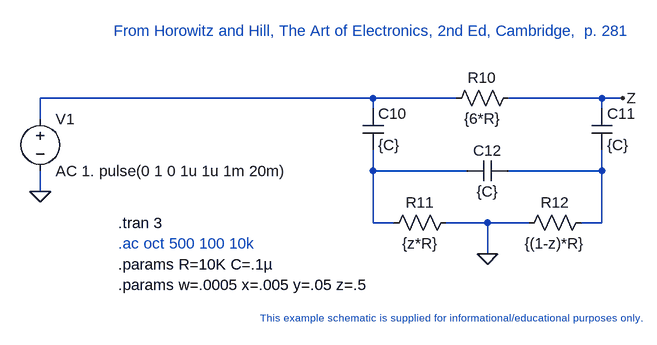
[diagram p0: schematic n.asc]
n.asc, the LTspice schematic file:
Version 4
SHEET 1 5945676 13421556
WIRE 3024 -432 2512 -432
WIRE 3152 -432 3024 -432
WIRE 3376 -432 3232 -432
WIRE 3408 -432 3376 -432
WIRE 3024 -416 3024 -432
WIRE 3376 -416 3376 -432
WIRE 2512 -400 2512 -432
WIRE 3024 -320 3024 -352
WIRE 3168 -320 3024 -320
WIRE 3376 -320 3376 -352
WIRE 3376 -320 3232 -320
WIRE 2512 -288 2512 -320
WIRE 3024 -240 3024 -320
WIRE 3056 -240 3024 -240
WIRE 3200 -240 3136 -240
WIRE 3264 -240 3200 -240
WIRE 3376 -240 3376 -320
WIRE 3376 -240 3344 -240
WIRE 3200 -192 3200 -240
FLAG 2512 -288 0
FLAG 3200 -192 0
FLAG 3408 -432 Z
SYMBOL voltage 2512 -416 R0
SYMATTR InstName V1
SYMATTR Value AC 1. pulse(0 1 0 1u 1u 1m 20m)
SYMBOL res 3248 -448 R90
WINDOW 0 0 56 VBottom 2
WINDOW 3 32 56 VTop 2
SYMATTR InstName R10
SYMATTR Value {6*R}
SYMBOL cap 3008 -416 R0
SYMATTR InstName C10
SYMATTR Value {C}
SYMBOL cap 3360 -416 R0
SYMATTR InstName C11
SYMATTR Value {C}
SYMBOL cap 3232 -336 R90
WINDOW 0 0 32 VBottom 2
WINDOW 3 32 32 VTop 2
SYMATTR InstName C12
SYMATTR Value {C}
SYMBOL res 3152 -256 R90
WINDOW 0 0 56 VBottom 2
WINDOW 3 32 56 VTop 2
SYMATTR InstName R11
SYMATTR Value {z*R}
SYMBOL res 3360 -256 R90
WINDOW 0 0 56 VBottom 2
WINDOW 3 32 56 VTop 2
SYMATTR InstName R12
SYMATTR Value {(1-z)*R}
TEXT 2632 -208 Left 2 ;.ac oct 500 100 10k
TEXT 2632 -176 Left 2 !.params R=10K C=.1µ
TEXT 3024 -520 Bottom 2 ;From Horowitz and Hill, The Art of Electronics, 2nd Ed, Cambridge,  p. 281
TEXT 2632 -144 Left 2 !.params w=.0005 x=.005 y=.05 z=.5
TEXT 3136 -104 Top 1 ;This example schematic is supplied for informational/educational purposes only.
TEXT 2632 -240 Left 2 !.tran 3

The netlist it stands for:
* n.asc
V1 N001 0 AC 1. pulse(0 1 0 1u 1u 1m 20m)
R10 Z N001 {6*R}
C10 N001 N002 {C}
C11 Z N003 {C}
C12 N003 N002 {C}
R11 0 N002 {z*R}
R12 N003 0 {(1-z)*R}
* .ac oct 500 100 10k
.params R=10K C=.1µ
* From Horowitz and Hill, The Art of Electronics, 2nd Ed, Cambridge,  p. 281
.params w=.0005 x=.005 y=.05 z=.5
* This example schematic is supplied for informational/educational purposes only.
.tran 3
.backanno
.end